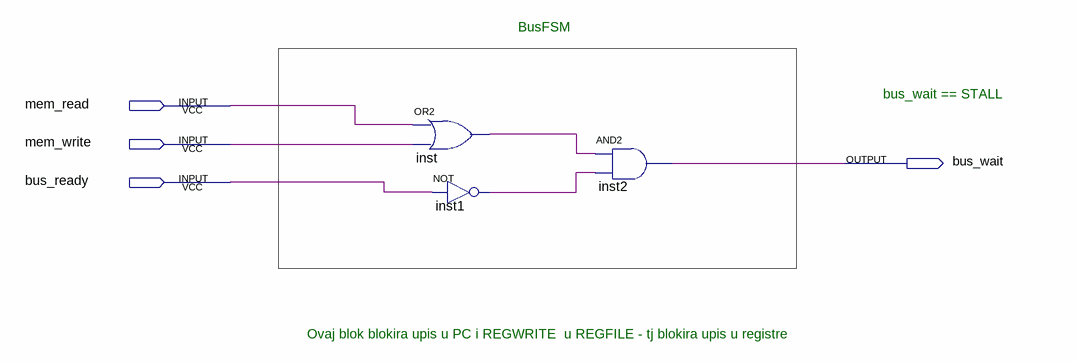
[diagram p0: schematic sheet]
// Quartus schematic BusFSM2.bdf as structural Verilog: 3 symbols, 4 pins
module BusFSM2 (
  input  mem_read,
  input  mem_write,
  input  bus_ready,
  output bus_wait
);

  wire inst1_out, inst_out;

  or inst (inst_out, mem_read, mem_write);
  not inst1 (inst1_out, bus_ready);
  and inst2 (bus_wait, inst_out, inst1_out);

  // Notes on the sheet:
  //   BusFSM
  //   bus_wait == STALL
  //   Ovaj blok blokira upis u PC i REGWRITE  u REGFILE - tj blokira upis u registre
endmodule
